# Altium schematic sheet fantom_power_enabler.SchDoc
size A4
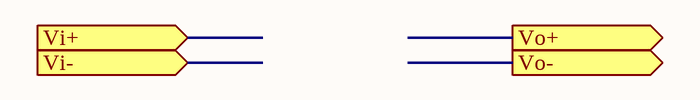
[diagram p0: fantom_power_enabler.SchDoc]

## Ports
Vi+ (in), Vi- (in), Vo+ (out), Vo- (out)